# Altium project uno.PrjPcb (part 1 of 3)
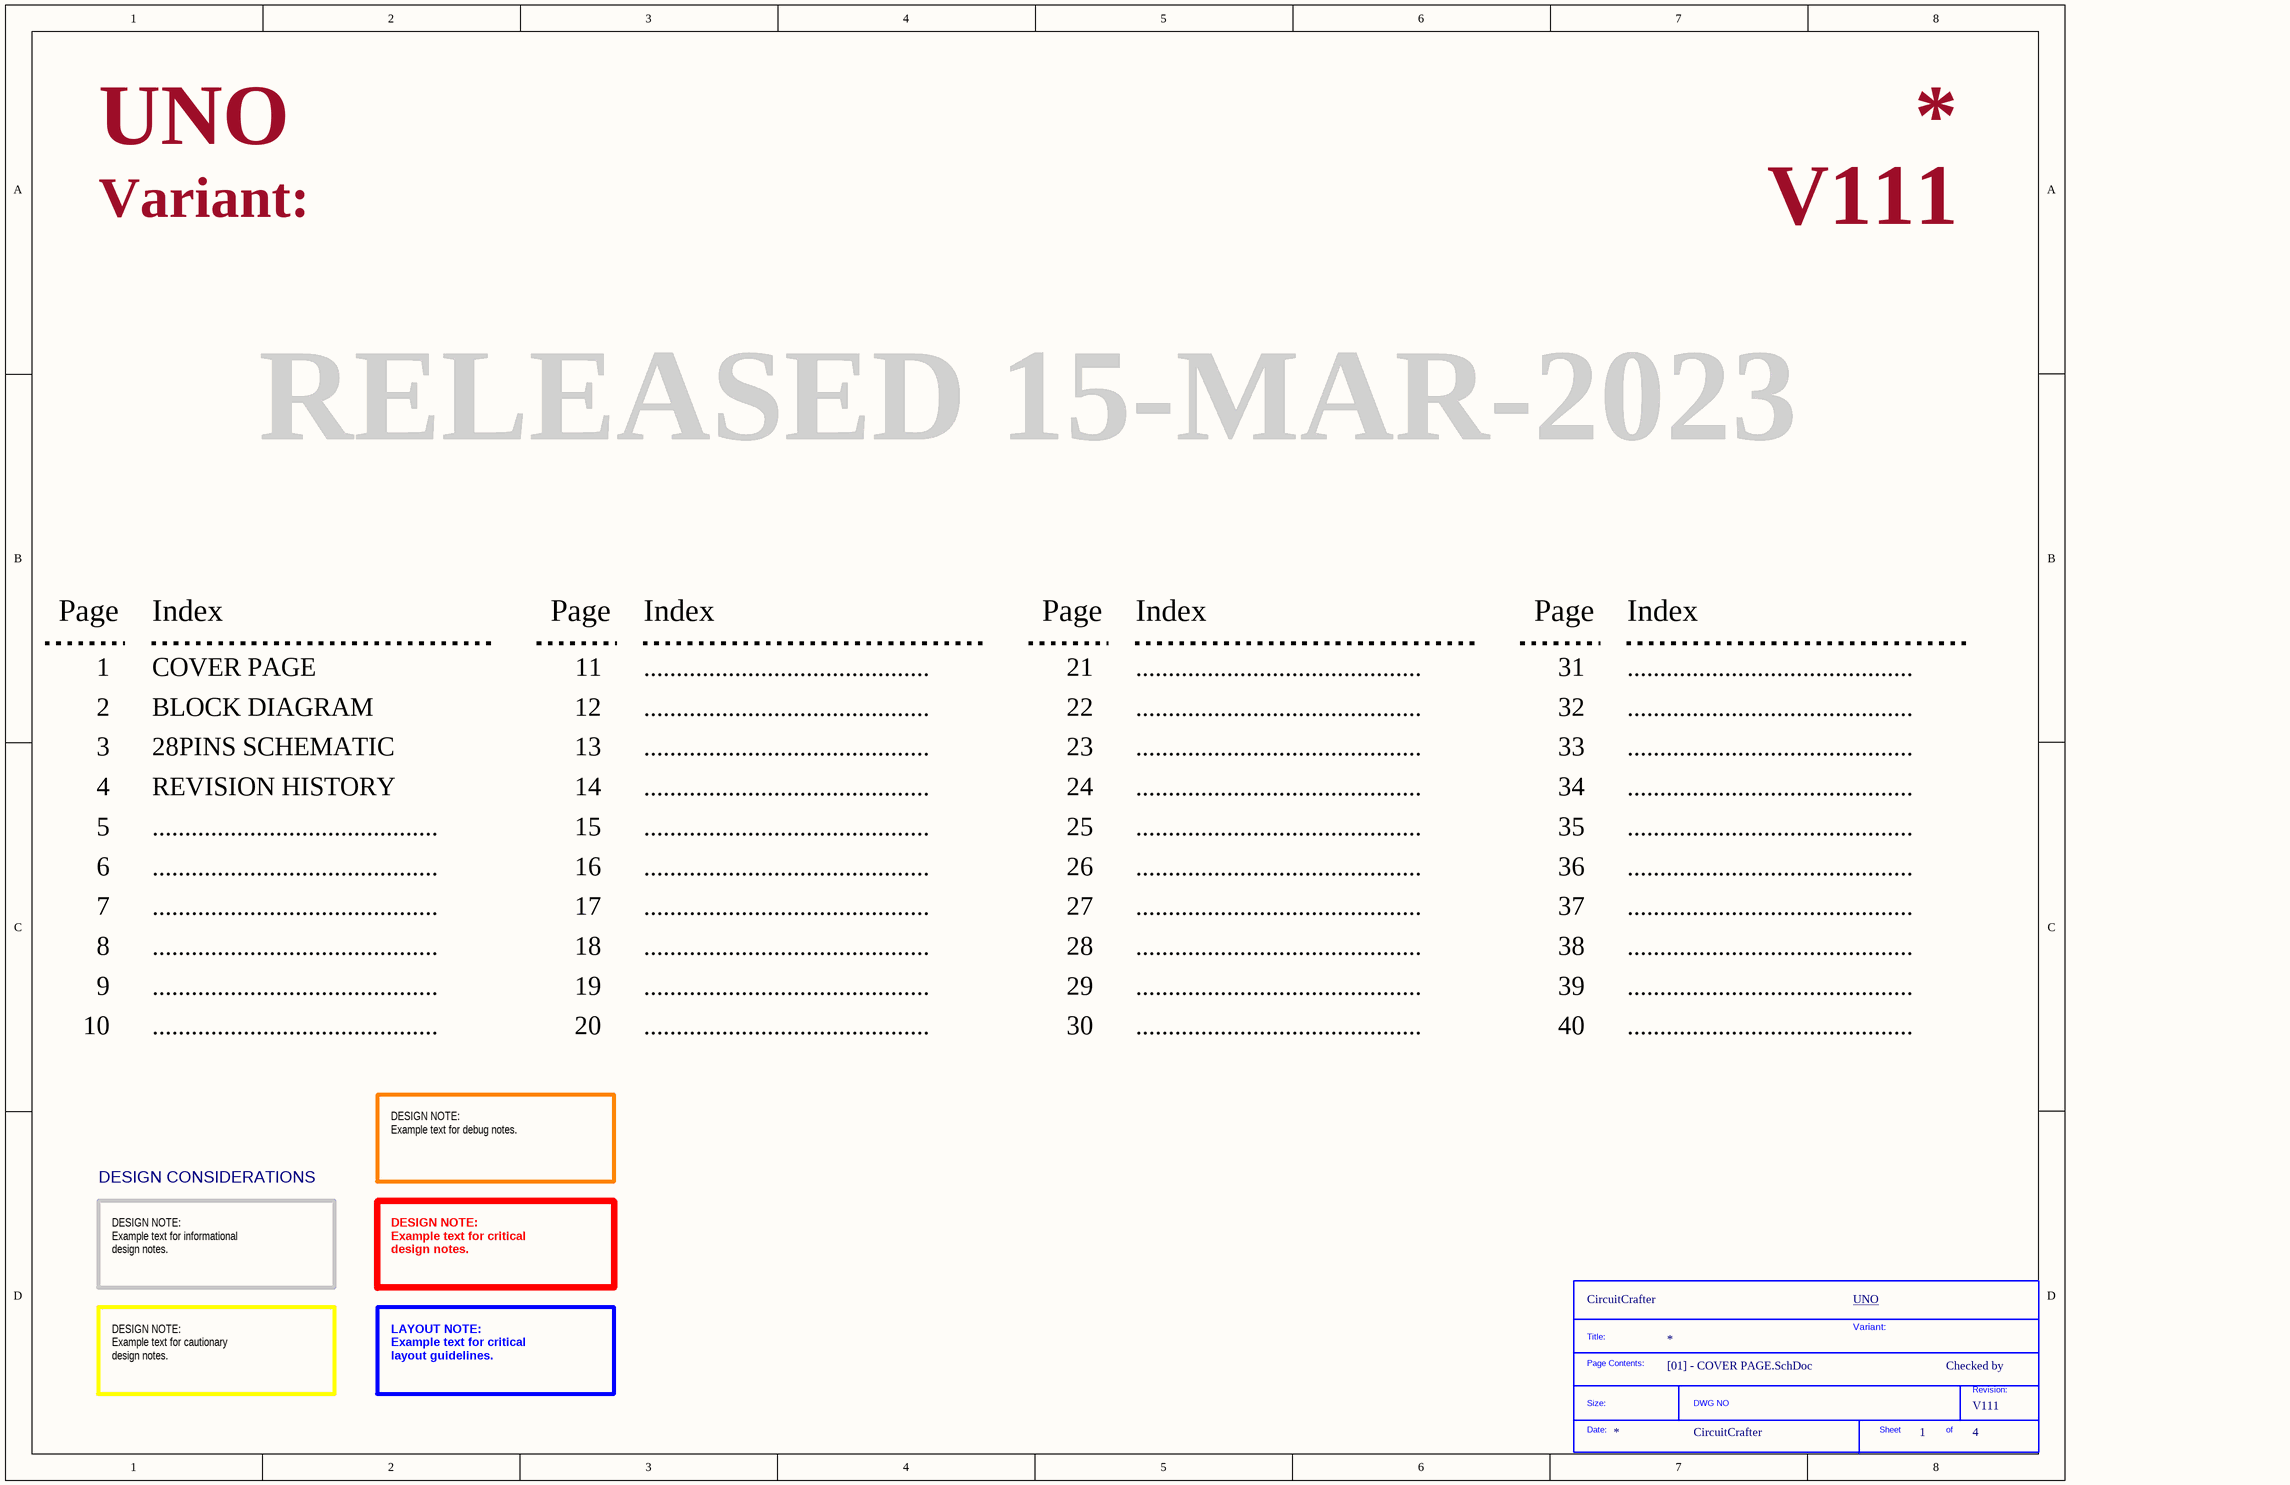
[diagram p0: [01] - COVER PAGE.SchDoc]
Company: CircuitCrafter; Project: UNO; Tittle: UNO; VersionRevison: V111
4 sheets, 112 parts. Net scope: global (net labels, ports and power ports of the same name join across sheets).
Board file: UNO.PcbDoc
Sheets:
  [01] - COVER PAGE.SchDoc
  [02] - BLOCK DIAGRAM.SchDoc
  [03] - 28PINSCHEMATIC.SchDoc
  [04] - REVISION HISTORY.SchDoc

## Sheet [01] - COVER PAGE.SchDoc
size A3; DocumentNumber: 1; SheetNumber: 1; SheetTotal: 4

### Parts
(Parts that share a designator on the sheet are numbered #1, #2 ... from top to bottom, then left to right.)
*#1  SDTitleBlock  (value not drawn)  (graphical)

### Notes on the sheet
- UNO
- Variant:
- RELEASED 15-MAR-2023
- Page
- Index
- 1
- COVER PAGE
- 11
- ............................................
- 21
- 31
- 2
- 3
- BLOCK DIAGRAM
- 28PINS SCHEMATIC
- 12
- 13
- 22
- 23
- 32
- 33
- 4
- 5
- REVISION HISTORY
- 14
- 15
- 24
- 25
- 34
- 35
- 6
- 16
- 26
- 36
- 7
- 8
- 17
- 18
- 27
- 28
- 37
- 38
- 9
- 10
- 19
- 20
- 29
- 30
- 39
- 40
- DESIGN NOTE:
  Example text for debug notes.
- DESIGN CONSIDERATIONS
- DESIGN NOTE:
  Example text for informational
  design notes.
- DESIGN NOTE:
  Example text for critical
  design notes.
- Checked by
- DESIGN NOTE:
  Example text for cautionary
  design notes.
- LAYOUT NOTE:
  Example text for critical
  layout guidelines.
- (in symbol SDTitleBlock) Title:; Page Contents:; Revision:; Size:; DWG NO; Date:; Sheet; of

## Sheet [02] - BLOCK DIAGRAM.SchDoc
size A3; DocumentNumber: 2; SheetNumber: 2; SheetTotal: 4; PageSetup: Record=PageOptions|CenterHorizontal=True|CenterVertical=True|PrintScale=0.52|XCorrection=1.00|YCorrection=1.00|PrintKind=1|BorderSize=5000000|LeftOffset=0|BottomOffset=0|Orientation=2|PaperLength=1000|PaperWidth=1000|Scale=100|PaperSource=4|PrintQuality=600|MediaType=1|DitherType=10|PrintScaleMode=1|PaperKind=A4|PaperIndex=9
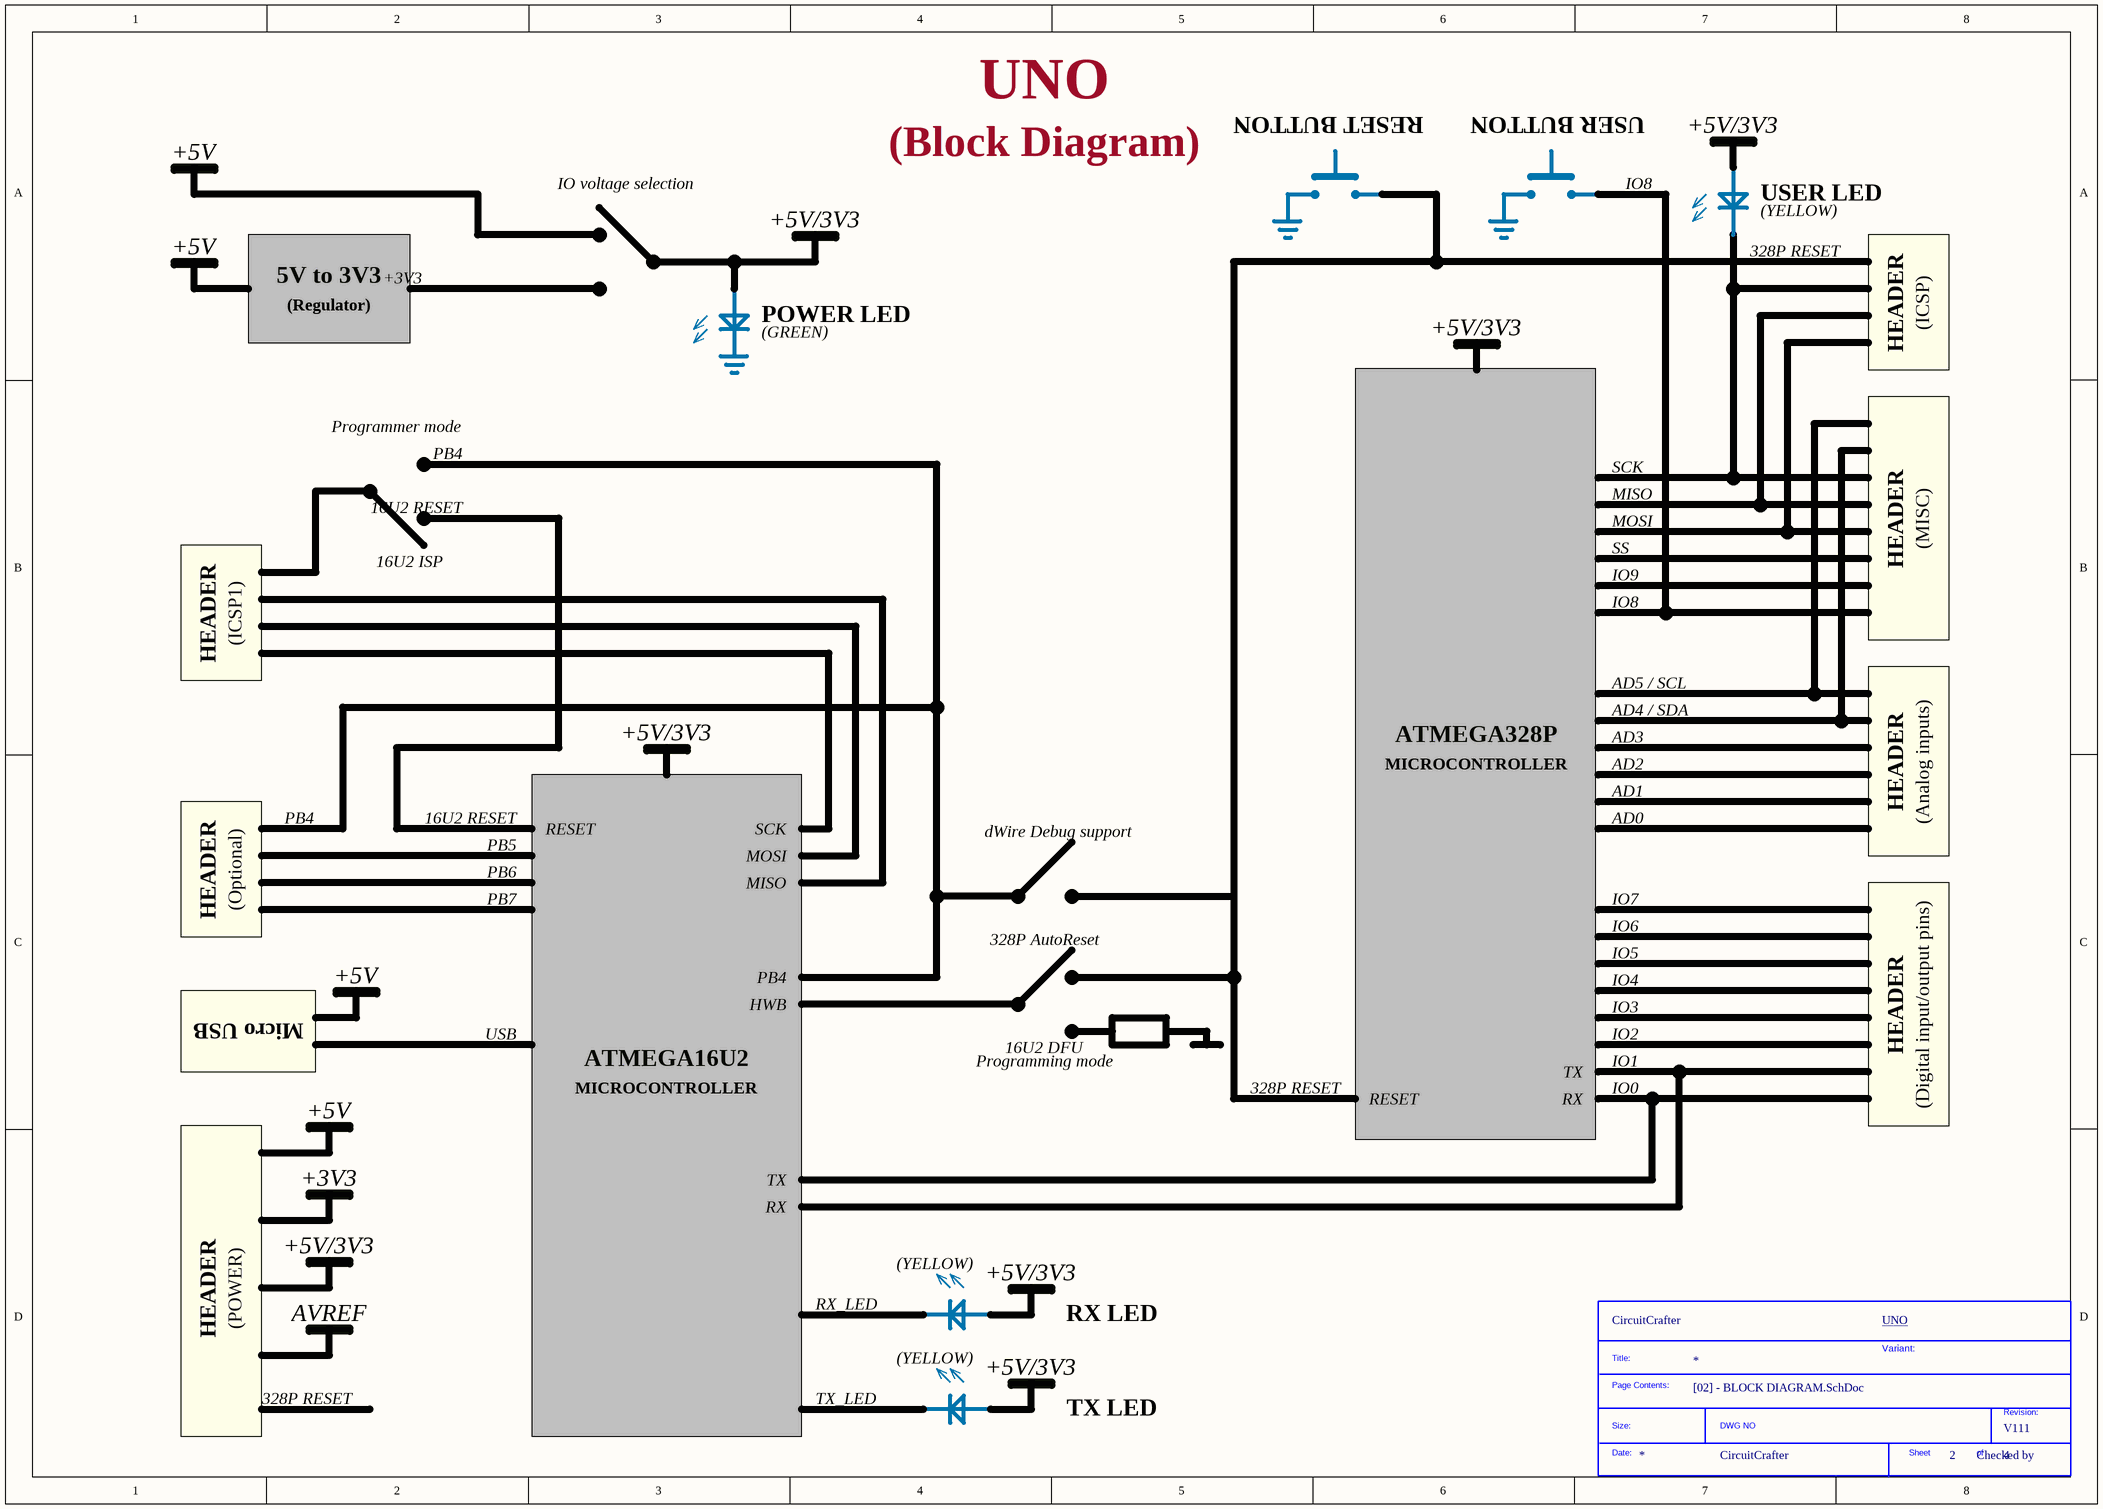
[diagram p1: [02] - BLOCK DIAGRAM.SchDoc]

### Parts
(Parts that share a designator on the sheet are numbered #1, #2 ... from top to bottom, then left to right.)
*#2  SDTitleBlock  (value not drawn)  (graphical)

### Notes on the sheet
- +5V
- (Block Diagram)
- RESET BUTTON
- USER BUTTON
- +5V/3V3
- IO voltage selection
- IO8
- USER LED
- (YELLOW)
- 5V to 3V3
- (Regulator)
- +3V3
- 328P RESET
- HEADER
- (ICSP)
- POWER LED
- (GREEN)
- Programmer mode
- PB4
- 16U2 RESET
- MISO
- SCK
- (MISC)
- 16U2 ISP
- SS
- IO9
- MOSI
- (ICSP1)
- AD5 / SCL
- AD4 / SDA
- ATMEGA328P
- MICROCONTROLLER
- AD3
- AD2
- (Analog inputs)
- PB5
- RESET
- dWire Debug support
- AD1
- AD0
- (Optional)
- PB6
- PB7
- IO7
- 328P AutoReset
- IO6
- IO5
- IO4
- Micro USB
- USB
- ATMEGA16U2
- HWB
- 16U2 DFU
- IO3
- IO2
- (Digital input/output pins)
- Programming mode
- RX
- TX
- IO1
- IO0
- (POWER)
- AVREF
- RX_LED
- RX LED
- Variant:
- TX_LED
- TX LED
- Checked by
- (in symbol SDTitleBlock) Title:; Page Contents:; Revision:; Size:; DWG NO; Date:; Sheet; of

## Sheet [03] - 28PINSCHEMATIC.SchDoc
size A2; DocumentNumber: 3; SheetNumber: 3; SheetTotal: 4
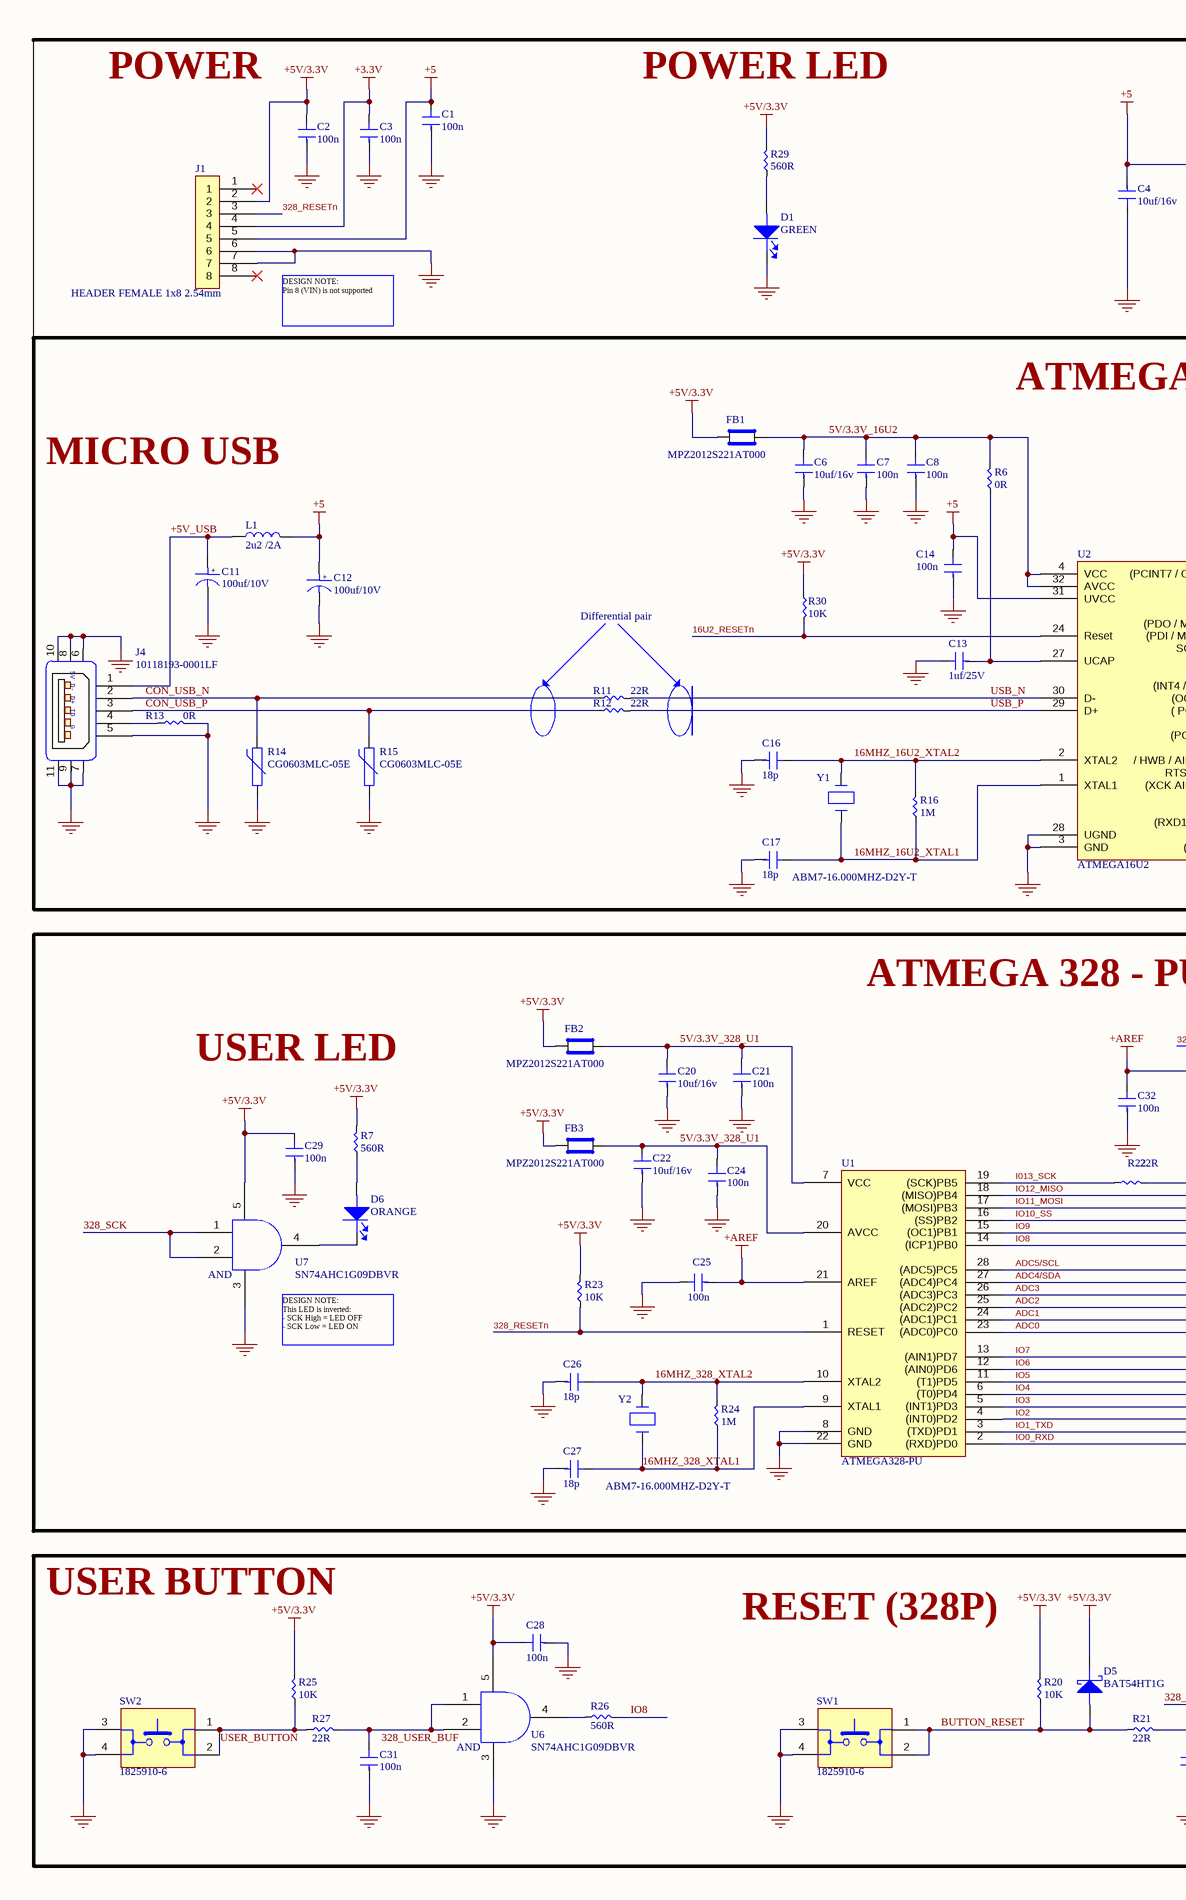
[diagram p2: [03] - 28PINSCHEMATIC.SchDoc, left]
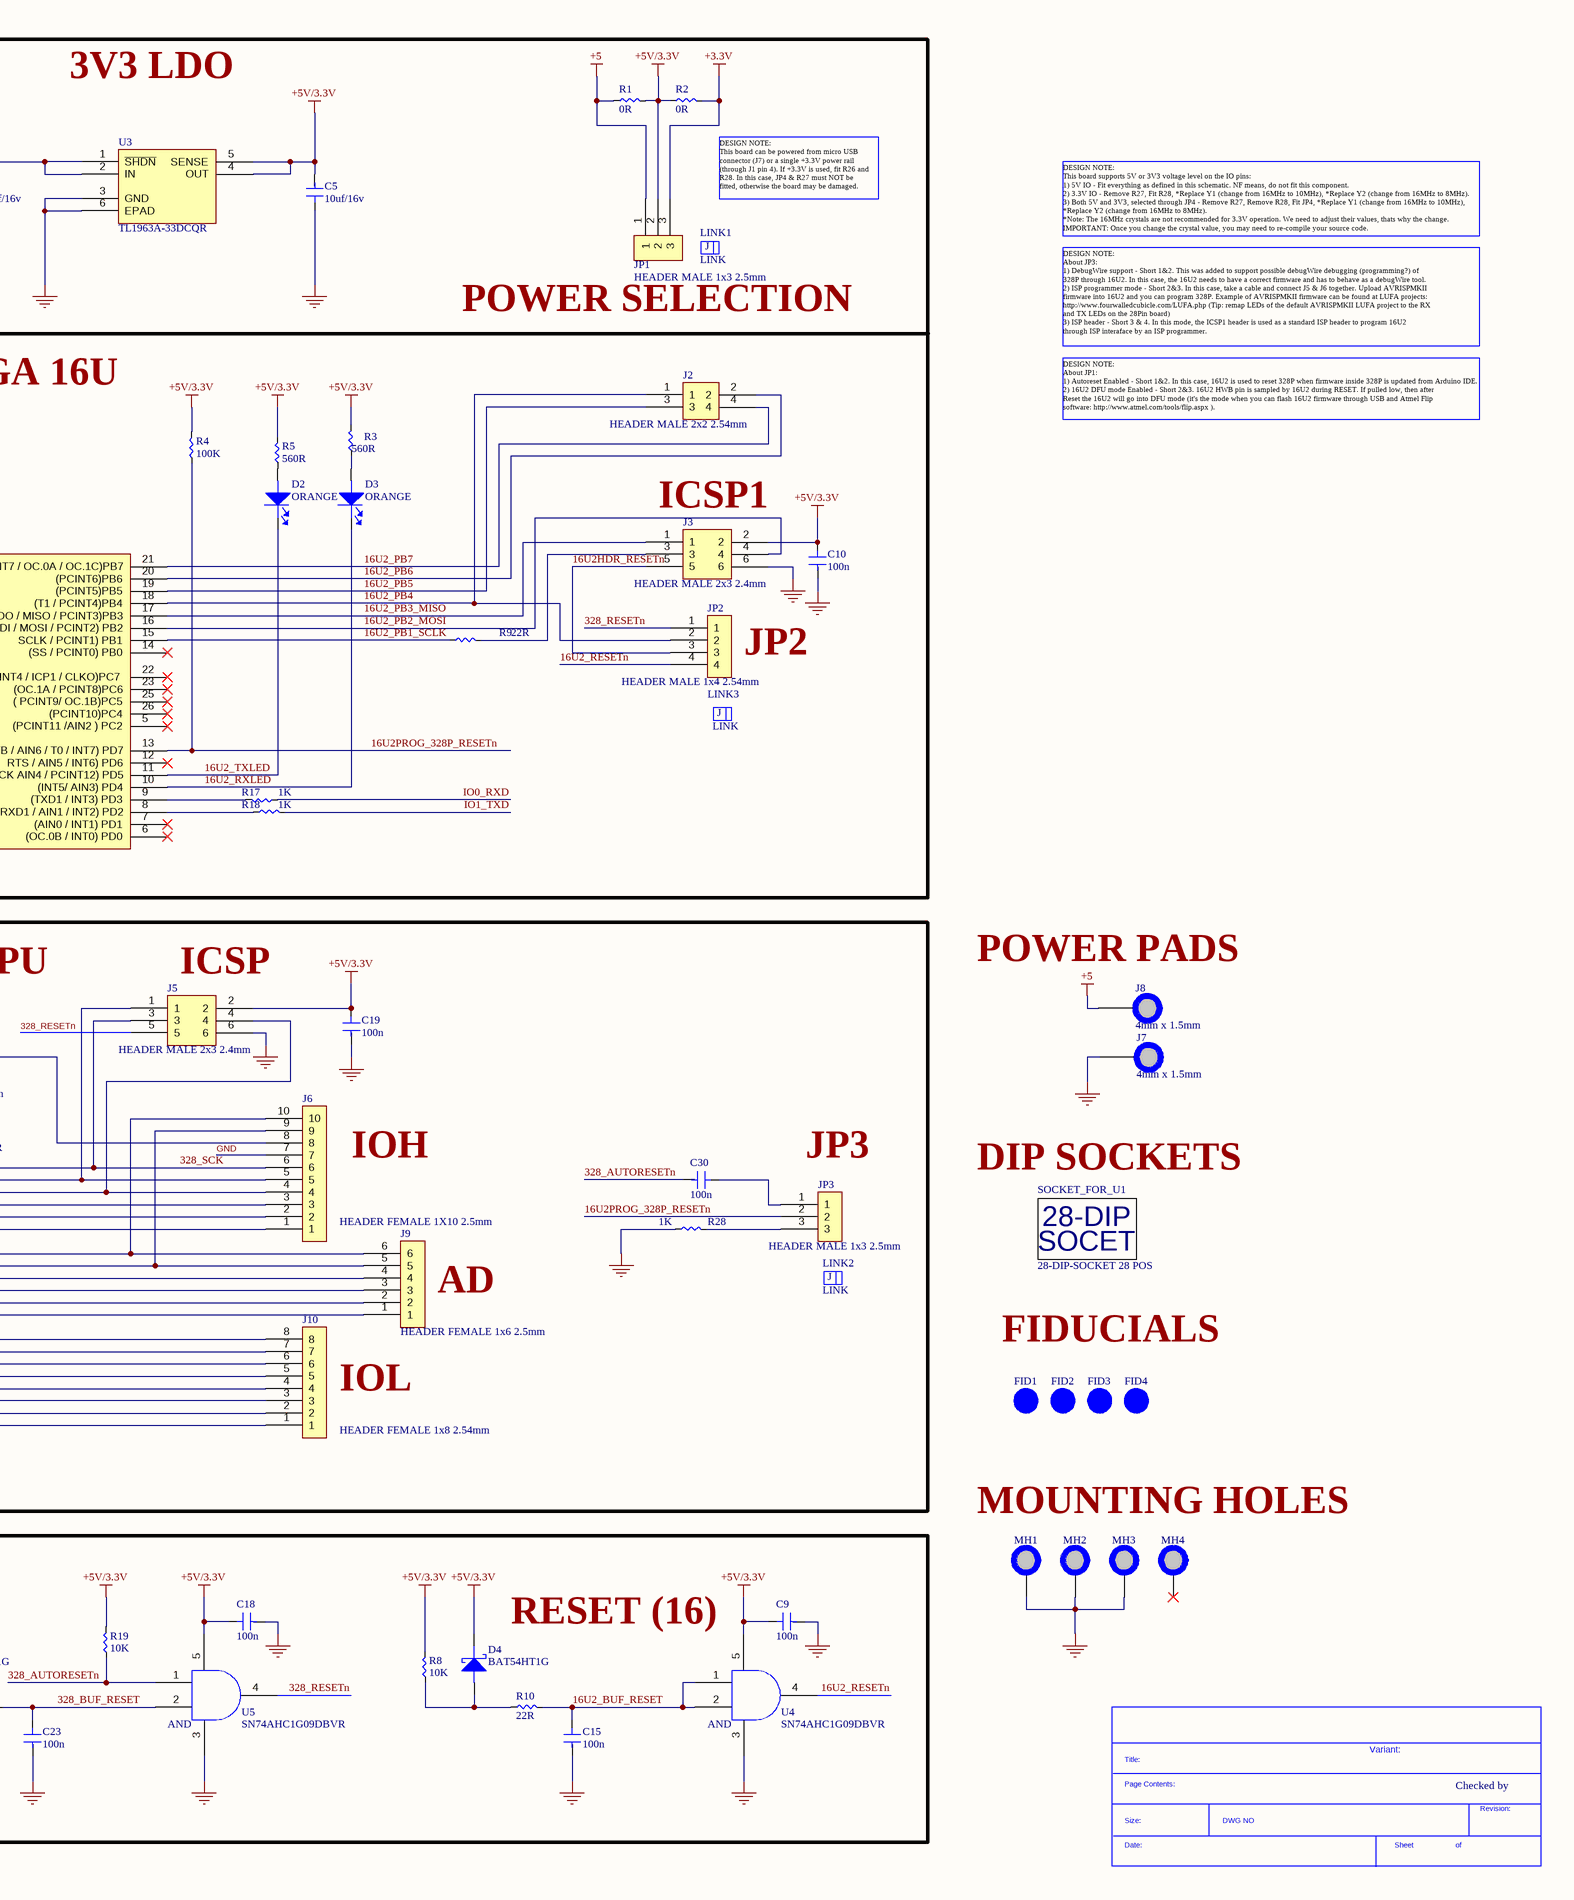
[diagram p3: [03] - 28PINSCHEMATIC.SchDoc, right]

### Parts
*?  SDTitleBlock  (value not drawn)  (graphical)
C1  100n  [C0805]
C2  100n  [C0805]
C3  100n  [C0805]
C4  10uf/16v  [C0805]
C5  10uf/16v  [C0805]
C6  10uf/16v  [C0805]
C7  100n  [C0805]
C8  100n  [C0805]
C9  100n  [C0805]
C10  100n  [C0805]
C11  100uf/10V  [C_ALU_SIZE]
C12  100uf/10V  [C_ALU_SIZE]
C13  1uf/25V  [C0805]
C14  100n  [C0805]
C15  100n  [C0805]
C16  18p  [C0805]
C17  18p  [C0805]
C18  100n  [C0805]
C19  100n  [C0805]
C20  10uf/16v  [C0805]
C21  100n  [C0805]
C22  10uf/16v  [C0805]
C23  100n  [C0805]
C24  100n  [C0805]
C25  100n  [C0805]
C26  18p  [C0805]
C27  18p  [C0805]
C28  100n  [C0805]
C29  100n  [C0805]
C30  100n  [C0805]
C31  100n  [C0805]
C32  100n  [C0805]
D1  GREEN  [LED0603]
D2  ORANGE  [LED0603]
D3  ORANGE  [LED0603]
D4  BAT54HT1G  [BAT54HT1G]
D5  BAT54HT1G  [BAT54HT1G]
D6  ORANGE  [LED0603]
FB1  MPZ2012S221AT000  [C0805]
FB2  MPZ2012S221AT000  [C0805]
FB3  MPZ2012S221AT000  [C0805]
FID1  FIC_1_MMC  [FID_40 x120]  (value not drawn)  (no BOM)
FID2  FIC_1_MMC  [FID_40 x120]  (value not drawn)  (no BOM)
FID3  FIC_1_MMC  [FID_40 x120]  (value not drawn)  (no BOM)
FID4  FIC_1_MMC  [FID_40 x120]  (value not drawn)  (no BOM)
J1  HEADER FEMALE 1x8 2.54mm  [HEADER FEMALE 1x8 2.54mm]
J2  HEADER MALE 2x2 2.54mm  [HEADER MALE 2x2 2.54mm]
J3  HEADER MALE 2x3 2.4mm  [HEADER MALE 2x3 2.54mm]
J4  10118193-0001LF  [10118193-0001LF - 2]
J5  HEADER MALE 2x3 2.4mm  [HEADER MALE 2x3 2.54mm]
J6  HEADER FEMALE 1X10 2.5mm  [HEADER FEMALE 1X10 2.5mm]
J7  4mm x 1.5mm  [PAD_with Hole 4mm x 1.5mm]  (no BOM)
J8  4mm x 1.5mm  [PAD_with Hole 4mm x 1.5mm]  (no BOM)
J9  HEADER FEMALE 1x6 2.5mm  [HEADER FEMALE 1x6 2.54m]
J10  HEADER FEMALE 1x8 2.54mm  [HEADER FEMALE 1x8 2.54mm]
JP1  HEADER MALE 1x3 2.5mm  [HEADER MALE 1x3 2.54mm]
JP2  HEADER MALE 1x4 2.54mm  [HEADER MALE 1x4 2.54m]
JP3  HEADER MALE 1x3 2.5mm  [HEADER MALE 1x3 2.54mm]
L1  2u2 /2A  [C1210_IND]
LINK1  LINK  (mechanical)
LINK2  LINK  (mechanical)
LINK3  LINK  (mechanical)
MH1  MH_7.4x3.2  [MH_7.4mm_3.2mm]  (value not drawn)  (no BOM)
MH2  MH_7.4x3.2  [MH_7.4mm_3.2mm]  (value not drawn)  (no BOM)
MH3  MH_7.4x3.2  [MH_7.4mm_3.2mm]  (value not drawn)  (no BOM)
MH4  MH_7.4mm_3.2mm_NP  [MH_7.4mm_3.2mm_NP]  (value not drawn)  (no BOM)
R1  0R  [R0805]
R2  0R  [R0805]
R3  560R  [R0805]
R4  100K  [R0805]
R5  560R  [R0805]
R6  0R  [R0805]
R7  560R  [R0805]
R8  10K  [R0805]
R9  22R  [R0805]
R10  22R  [R0805]
R11  22R  [R0805]
R12  22R  [R0805]
R13  0R  [R0805]
R14  CG0603MLC-05E  [R0603]
R15  CG0603MLC-05E  [R0603]
R16  1M  [R0805]
R17  1K  [R0805]
R18  1K  [R0805]
R19  10K  [R0805]
R20  10K  [R0805]
R21  22R  [R0805]
R22  22R  [R0805]
R23  10K  [R0805]
R24  1M  [R0805]
R25  10K  [R0805]
R26  560R  [R0805]
R27  22R  [R0805]
R28  1K  [R0805]
R29  560R  [R0805]
R30  10K  [R0805]
SOCKET_FOR_U1  28-DIP-SOCKET 28 POS  [28-DIP-7.5MM SOCKET]
SW1  1825910-6  [1825910-6]
SW2  1825910-6  [1825910-6]
U1  ATMEGA328-PU  [ATMEGA328pu]
U2  ATMEGA16U2  [ATMEGA16U]
U3  TL1963A-33DCQR  [TL1963A-33DCQR]
U4  SN74AHC1G09DBVR  [SN74AHC1G09DBVR]
U5  SN74AHC1G09DBVR  [SN74AHC1G09DBVR]
U6  SN74AHC1G09DBVR  [SN74AHC1G09DBVR]
U7  SN74AHC1G09DBVR  [SN74AHC1G09DBVR]
Y1  ABM7-16.000MHZ-D2Y-T  [ABM7-16.000MHZ-D2Y-T]
Y2  ABM7-16.000MHZ-D2Y-T  [ABM7-16.000MHZ-D2Y-T]

### Nets
+3.3V: C3.2 J1.4 JP1.3 R2.2
+5: C1.2 C4.1 C12.1 C14.2 J1.5 J8.1 JP1.1 L1.2 R1.1 U2.31(UVCC) U3.1(~{SHDN}) U3.2(IN)
+5V/3.3V: C2.2 C5.1 C9.2 C10.2 C18.2 C19.2 C28.2 C29.2 D4.1(CATHODE) D5.1(CATHODE) FB1.1 FB2.1 FB3.1 J1.2 J3.2 J5.2 JP1.2 R1.2 R2.1 R3.2 R4.2 R5.2 R7.2 R8.2 R19.2 R20.2 R23.2 R25.2 R29.2 R30.1 U3.4(OUT) U3.5(SENSE) U4.5 U5.5 U6.5 U7.5
+AREF: C25.1 C32.2 J6.8 U1.21(AREF)
GND: C1.1 C2.1 C3.1 C4.2 C5.2 C6.1 C7.1 C8.1 C9.1 C10.1 C11.2 C12.2 C13.2 C14.1 C15.1 C16.1 C17.1 C18.1 C19.1 C20.1 C21.1 C22.1 C23.1 C24.1 C25.2 C26.1 C27.1 C28.1 C29.1 C31.1 C32.1 D1.1(CATHODE) J1.6 J1.7 J3.6 J4.5 J4.6 J4.7 J4.8 J4.9 J4.10 J4.11 J5.6 J6.7 J7.1 MH1.1 MH2.1 MH3.1 R13.2 R14.1 R15.1 R28.1 SW1.3 SW1.4 SW2.3 SW2.4 U1.8(GND) U1.22(GND) U2.3(GND) U2.28(UGND) U3.3(GND) U3.6(EPAD) U4.3 U5.3 U6.3 U7.3
5V/3.3V_16U2: C6.2 C7.2 C8.2 FB1.2 R6.2 U2.4(VCC) U2.32(AVCC)
5V/3.3V_328_U1: C20.2 C21.2 C22.2 C24.2 FB2.2 FB3.2 U1.7(VCC) U1.20(AVCC)
16MHZ_16U2_XTAL1: C17.2 R16.1 U2.1(XTAL1) Y1.1
16MHZ_16U2_XTAL2: C16.2 R16.2 U2.2(XTAL2) Y1.2
16MHZ_328_XTAL1: C27.2 R24.1 U1.9(XTAL1) Y2.1
16MHZ_328_XTAL2: C26.2 R24.2 U1.10(XTAL2) Y2.2
16U2_BUF_RESET: C15.2 R10.2 U4.1 U4.2
16U2_PB1_SCLK: R9.1 U2.15(SCLK_/_PCINT1)_PB1)
16U2_PB2_MOSI: J3.4 U2.16((PDI_/_MOSI_/_PCINT2)_PB2)
16U2_PB3_MISO: J3.1 U2.17((PDO_/_MISO_/_PCINT3)PB3)
16U2_PB4: J2.1 JP2.2 U2.18((T1_/_PCINT4)PB4)
16U2_PB5: J2.3 U2.19((PCINT5)PB5)
16U2_PB6: J2.2 U2.20((PCINT6)PB6)
16U2_PB7: J2.4 U2.21((PCINT7_/_OC.0A_/_OC.1C)PB7)
16U2_RESETn: JP2.4 R30.2 U2.24(Reset) U4.4
16U2_RXLED: D3.1(CATHODE) U2.10((INT5/_AIN3)_PD4)
16U2_TXLED: D2.1(CATHODE) U2.11((XCK_AIN4_/_PCINT12)_PD5)
16U2HDR_RESETn: J3.5 JP2.3
16U2PROG_328P_RESETn: JP3.2 R4.1 U2.13(/_HWB_/_AIN6_/_T0_/_INT7)_PD7)
328_AUTORESETn: C30.1 R19.1 U5.1
328_BUF_RESET: C23.2 R21.2 U5.2
328_RESETn: J1.3 J5.5 JP2.1 R23.1 U1.1(RESET) U5.4
328_SCK: J5.3 J6.6 R22.2 U7.1 U7.2
328_USER_BUF: C31.2 R27.2 U6.1 U6.2
+5V_USB: C11.1 J4.1 L1.1
ADC0: J9.1 U1.23((ADC0)PC0)
ADC1: J9.2 U1.24((ADC1)PC1)
ADC2: J9.3 U1.25((ADC2)PC2)
ADC3: J9.4 U1.26((ADC3)PC3)
ADC4/SDA: J6.9 J9.5 U1.27((ADC4)PC4)
ADC5/SCL: J6.10 J9.6 U1.28((ADC5)PC5)
BUTTON_RESET: D5.2(ANODE) R20.1 R21.1 SW1.1 SW1.2
CON_USB_N: J4.2 R11.1 R14.2
CON_USB_P: J4.3 R12.1 R15.2
I013_SCK: R22.1 U1.19((SCK)PB5)
IO0_RXD: J10.1 R17.1 U1.2((RXD)PD0)
IO1_TXD: J10.2 R18.2 U1.3((TXD)PD1)
IO2: J10.3 U1.4((INT0)PD2)
IO3: J10.4 U1.5((INT1)PD3)
IO4: J10.5 U1.6((T0)PD4)
IO5: J10.6 U1.11((T1)PD5)
IO6: J10.7 U1.12((AIN0)PD6)
IO7: J10.8 U1.13((AIN1)PD7)
IO8: J6.1 R26.2 U1.14((ICP1)PB0)
IO9: J6.2 U1.15((OC1)PB1)
IO10_SS: J6.3 U1.16((SS)PB2)
IO11_MOSI: J5.4 J6.4 U1.17((MOSI)PB3)
IO12_MISO: J5.1 J6.5 U1.18((MISO)PB4)
USB_N: R11.2 U2.30(D-)
USB_P: R12.2 U2.29(D+)
USER_BUTTON: R25.1 R27.1 SW2.1 SW2.2
NetC13_1: C13.1 R6.1 U2.27(UCAP)
NetC30_2: C30.2 JP3.1
NetD1_2: D1.2(ANODE) R29.1
NetD2_2: D2.2(ANODE) R5.1
NetD3_2: D3.2(ANODE) R3.1
NetD4_2: D4.2(ANODE) R8.1 R10.1
NetD6_1: D6.1(CATHODE) U7.4
NetD6_2: D6.2(ANODE) R7.1
NetJ3_3: J3.3 R9.2
NetJ4_4: J4.4 R13.1
NetJP3_3: JP3.3 R28.2
NetR17_2: R17.2 U2.9((TXD1_/_INT3)_PD3)
NetR18_1: R18.1 U2.8((RXD1_/_AIN1_/_INT2)_PD2)
NetR26_1: R26.1 U6.4

Not connected (* = marked no-connect by the designer): J1 1* 8*; MH4 1*; U2 5((PCINT11_/AIN2_)_PC2)* 6((OC.0B_/_INT0)_PD0)* 7((AIN0_/_INT1)_PD1)* 12(RTS_/_AIN5_/_INT6)_PD6)* 14((SS_/_PCINT0)_PB0)* 22((INT4_/_ICP1_/_CLKO)PC7_)* 23((OC.1A_/_PCINT8)PC6)* 25((_PCINT9/_OC.1B)PC5)* 26((PCINT10)PC4)*

### Notes on the sheet
- POWER
- POWER LED
- 3V3 LDO
- DESIGN NOTE:
  This board can be powered from micro USB
  connector (J7) or a single +3.3V power rail
  (through J1 pin 4). If +3.3V is used, fit R26 and
  R28. In this case, JP4 & R27 must NOT be
  fitted, otherwise the board may be damaged.
- DESIGN NOTE:
  This board supports 5V or 3V3 voltage level on the IO pins:
  1) 5V IO - Fit everything as defined in this schematic. NF means, do not fit this component.
  2) 3.3V IO - Remove R27, Fit R28, *Replace Y1 (change from 16MHz to 10MHz), *Replace Y2 (change from 16MHz to 8MHz).
  3) Both 5V and 3V3, selected through JP4 - Remove R27, Remove R28, Fit JP4, *Replace Y1 (change from 16MHz to 10MHz), *Replace Y2 (change from 16MHz to 8MHz).
  *Note: The 16MHz crystals are not recommended for 3.3V operation. We need to adjust their values, thats why the change.
  IMPORTANT: Once you change the crystal value, you may need to re-compile your source code.
- DESIGN NOTE:
  Pin 8 (VIN) is not supported
- POWER SELECTION
- ATMEGA 16U
- DESIGN NOTE:
  About JP3:
  1) DebugWire support - Short 1&2. This was added to support possible debugWire debugging (programming?) of
  328P through 16U2. In this case, the 16U2 needs to have a correct firmware and has to behave as a debugWire tool.
  2) ISP programmer mode - Short 2&3. In this case, take a cable and connect J5 & J6 together. Upload AVRISPMKII
  firmware into 16U2 and you can program 328P. Example of AVRISPMKII firmware can be found at LUFA projects:
  http://www.fourwalledcubicle.com/LUFA.php (Tip: remap LEDs of the default AVRISPMKII LUFA project to the RX
  and TX LEDs on the 28Pin board)
  3) ISP header - Short 3 & 4. In this mode, the ICSP1 header is used as a standard ISP header to program 16U2
  through ISP interaface by an ISP programmer.
- DESIGN NOTE:
  About JP1:
  1) Autoreset Enabled - Short 1&2. In this case, 16U2 is used to reset 328P when firmware inside 328P is updated from Arduino IDE.
  2) 16U2 DFU mode Enabled - Short 2&3. 16U2 HWB pin is sampled by 16U2 during RESET. If pulled low, then after
  Reset the 16U2 will go into DFU mode (it's the mode when you can flash 16U2 firmware through USB and Atmel Flip
  software: http://www.atmel.com/tools/flip.aspx ).
- MICRO USB
- (near J3) ICSP1
- Differential pair
- JP2
- ATMEGA 328 - PU
- (near J5) ICSP
- (near J8) POWER PADS
- USER LED
- IOH
- (near JP3) JP3
- (near SOCKET_FOR_U1) DIP SOCKETS
- (near J9) AD
- (near U7) DESIGN NOTE:
  This LED is inverted:
  - SCK High = LED OFF
  - SCK Low = LED ON
- FIDUCIALS
- IOL
- MOUNTING HOLES
- USER BUTTON
- RESET (328P)
- RESET (16)
- Variant:
- Checked by
- DWG NO:
- REV:
- THIS DOCUMENT AND THE DATA DISCLOSED HEREIN OR
- HEREWITH IS THE PROPERTY OF ALTIUM LIMITED AND MAY
- BE FREELY DISTRIBUTED IN WHOLE. NO RIGHTS ARE
- RESERVED OR EXPRESS OR IMPLIED WARANTEE GIVEN.
- REVISION
- DESCRIPTION
- DATE
- APPROVED
- ENG:
- APPROVALS
- PROJECT
- DSN:
- CHK:
- REFERENCE DOCUMENTS
- PROJECT REVISION:
- TITLE
- DOCUMENT REVISION:
- DESIGN ITEM:
- BOM:
- FAB DWG:
- PCB DWG:
- ASSY DWG:
- SCALE:
- A2
- SIZE
- CAGE CODE
- FILE NAME
- DWG NO.
- SHEET
- OF
- REV
- (in symbol 4828-3004-CP) 28-DIP; SOCET
- (in symbol 10118193-0001LF) 5V; D-; D+; ID; G
- (in symbol EEE-1CA101WP) +
- (in symbol QPC02SXGN-RC) J
- (in symbol SDTitleBlock) Title:; Page Contents:; Revision:; Size:; DWG NO; Date:; Sheet; of
- (in symbol SN74AHC1G09DBVR) AND